# EAGLE design esp8266_esp01_shim_rev2 (EAGLE 6.5.0)
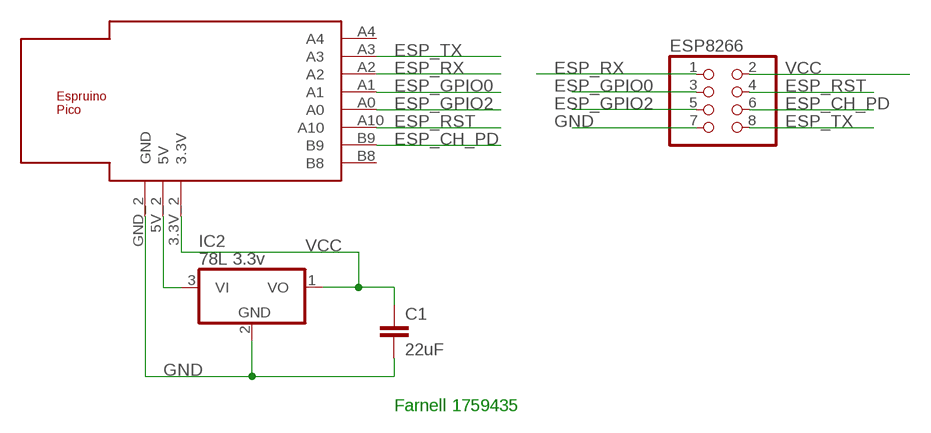
[diagram p0: schematic, sheet 1]

## Parts
C1  22uF  C-EUC1210  [C1210]
ESP8266  PINHD-2X4  [2X04]
IC2  78L 3.3v  78L05Z  [TO92]
U$1  ESPRUINO_PICO_0.05_SMALL  [ESPRUINO_PICO_0.05_SMALL]

## Nets
ESP_CH_PD: ESP8266.6 U$1.B9
ESP_GPIO0: ESP8266.3 U$1.A1
ESP_GPIO2: ESP8266.5 U$1.A0
ESP_RST: ESP8266.4 U$1.A10
ESP_RX: ESP8266.1 U$1.A2
ESP_TX: ESP8266.8 U$1.A3
GND: C1.2 ESP8266.7 IC2.2(GND) U$1.GND_2(GND)
N$1: IC2.3(VI) U$1.5V_2(5V)
VCC: C1.1 ESP8266.2 IC2.1(VO) U$1.3.3V_2(3.3V)
Unconnected: U$1.A4 U$1.B8

## Notes on the sheet
- Farnell 1759435

## Library data of the parts
C1 = rcl:C-EU: CAPACITOR, European symbol
ESP8266 = pinhead:PINHD-2X4: PIN HEADER
IC2 = linear:78*: Positive VOLTAGE REGULATOR Source: http://cache.national.com/ds/LM/LM78L05.pdf http://www.fairchildsemi.com/ds/LM/LM7805.pdf
U$1 = espruino_pico:ESPRUINO_PICO_0.05_SMALL

## Net classes
0 default: width 0.305 mm

## Board
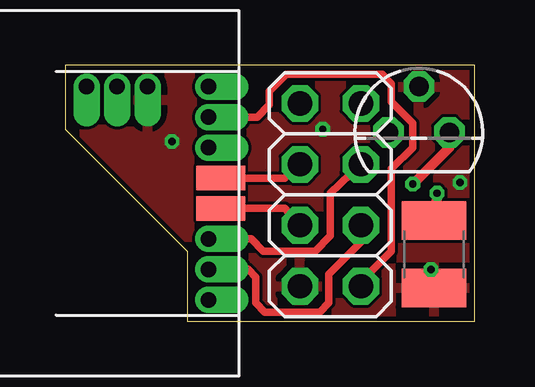
[diagram p1: board, top side]
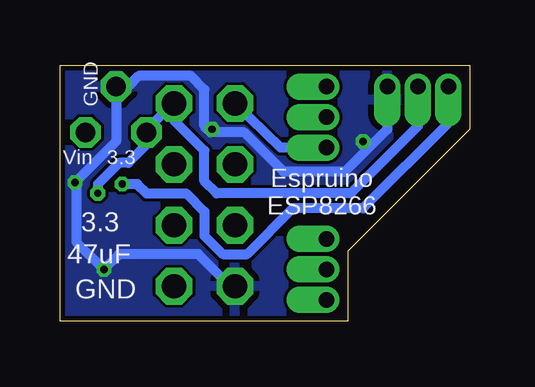
[diagram p2: board, bottom side, seen from below]

Size 17.07 x 10.66 mm. Coordinates in mm from the lower left corner, seen from the top.
Outline: 5.08,0 17.07,0 17.07,10.66 0,10.66 0,8 5.08,2.92 5.08,0
Copper layers (1*16): Top 0.035mm / dielectric 1.5mm / Bottom 0.035mm
Design rules "dirt_cheap_dirty_boards.v1 *": minimum track width 5mil, minimum drill 12mil, track to track 5mil, track to pad 5mil, pad to pad 5mil, via to via 5mil, smd to smd 0mil, copper to edge 8mil, drill to drill 10mil, minimum pad ring 9mil, minimum via ring 6mil, stop-mask expansion 2mil, vias tented up to drill 25mil, thermal gap 10mil

### Footprints (pad centres in the part's own frame; a part is rotated, then mirrored left to right if it is on the bottom)
C1210 = smd 1.6 x 2.7: 1 -1.4,0; 2 1.4,0
2X04 = drill 1.016 octagon: 1 -3.81,-1.27; 2 -3.81,1.27; 3 -1.27,-1.27; 4 -1.27,1.27; 5 1.27,-1.27; 6 1.27,1.27; 7 3.81,-1.27; 8 3.81,1.27
TO92 = drill 0.813 octagon: 1 -1.27,0; 2 0,1.905; 3 1.27,0
ESPRUINO_PICO_0.05_SMALL = drill 0.65 pad 0.965 offset: 3.3V_2 1.27,4.445; 5V_2 0,4.445; A2 5.08,1.905; A3 5.08,3.175; A4 5.08,4.445; A10 5.08,-1.905; B8 5.08,-4.445; B9 5.08,-3.175; GND_2 2.54,4.445 | smd 2.032 x 1.016: A0 5.588,-0.635; A1 5.588,0.635

### Placement (x,y rotation side)
C1  15.37,2.79 270 top
ESP8266  11.05,5.27 270 top
IC2  14.73,7.87 0 top
U$1  0.89,5.33 0 top

### Tracks (layer width: path | path; a pad name or v marks a point on that pad's centre or on a via)
ESP_CH_PD
  Top 0.305: U$1.B9 7.62,2.16 7.94,1.84 7.94,0.76 8.32,0.38 10.6,0.38 10.99,0.76 10.99,1.97 12.32,3.3 ESP8266.6
ESP_GPIO0
  Top 0.305: ESP8266.3 9.14,5.97 U$1.A1
ESP_GPIO2
  Top 0.305: ESP8266.5 9.14,4.7 U$1.A0
ESP_RST
  Top 0.305: ESP8266.4 11.05,5.33 11.05,3.56 10.41,2.92 8.26,2.92 7.75,3.43 U$1.A10
ESP_RX
  Bottom 0.406: U$1.A2 7.87,7.24 ESP8266.1
ESP_TX
  Top 0.305: U$1.A3 8,8.51 8.51,9.02 8.51,9.59 9.21,10.29 13.21,10.29 13.59,9.91 13.59,9.14 14.48,8.26 14.48,7.24 13.59,6.35 13.59,2.92 12.32,1.65 ESP8266.8
GND  (via drill 0.3)
  Top 0.406: C1.2 15.24,1.65 v15.24,2.16
  Bottom 0.406: U$1.GND_2 3.43,8 5.21,6.22 7.75,6.22 9.4,7.87 10.79,7.87 11.05,8.13 11.05,9.65 11.62,10.22 13.78,10.22 14.22,9.78 IC2.2 14.73,7.49 16.38,5.84 16.38,3.3 v15.24,2.16 14.61,2.79 11.3,2.79 10.03,1.52 ESP8266.7
  other vias: 4.45,7.49 10.73,8 16.45,5.78
  pour Bottom: -0.38,12.06 17.4,12.06 17.4,-1.91 -0.38,-1.91
  pour Top: -0.38,12.06 17.4,12.06 17.4,-1.91 -0.38,-1.91
N$1  (via drill 0.3)
  Top 0.406: v14.48,5.71 16,7.24 IC2.3
  Bottom 0.406: U$1.5V_2 0.89,8.26 4.45,4.7 7.37,4.7 9.27,2.79 10.29,2.79 11.05,3.56 11.05,4.57 11.81,5.33 13.46,5.33 13.84,5.71 v14.48,5.71
VCC  (via drill 0.3)
  Top 0.406: 15.75,4.45 C1.1 v15.49,5.33
  Bottom 0.406: U$1.3.3V_2 2.16,8.13 4.95,5.33 10.54,5.33 11.05,5.84 11.05,7.11 12.32,8.38 ESP8266.2 13.46,8 IC2.1 13.46,7.37 14.22,6.6 14.61,6.6 15.49,5.71 v15.49,5.33

### Text on the board
bNames: GND | 3.3 | Vin | Espruino / ESP8266 | 3.3 | 47uF | GND